# EAGLE design eCog100_ESP8266_Wifi (EAGLE 6.6.0)
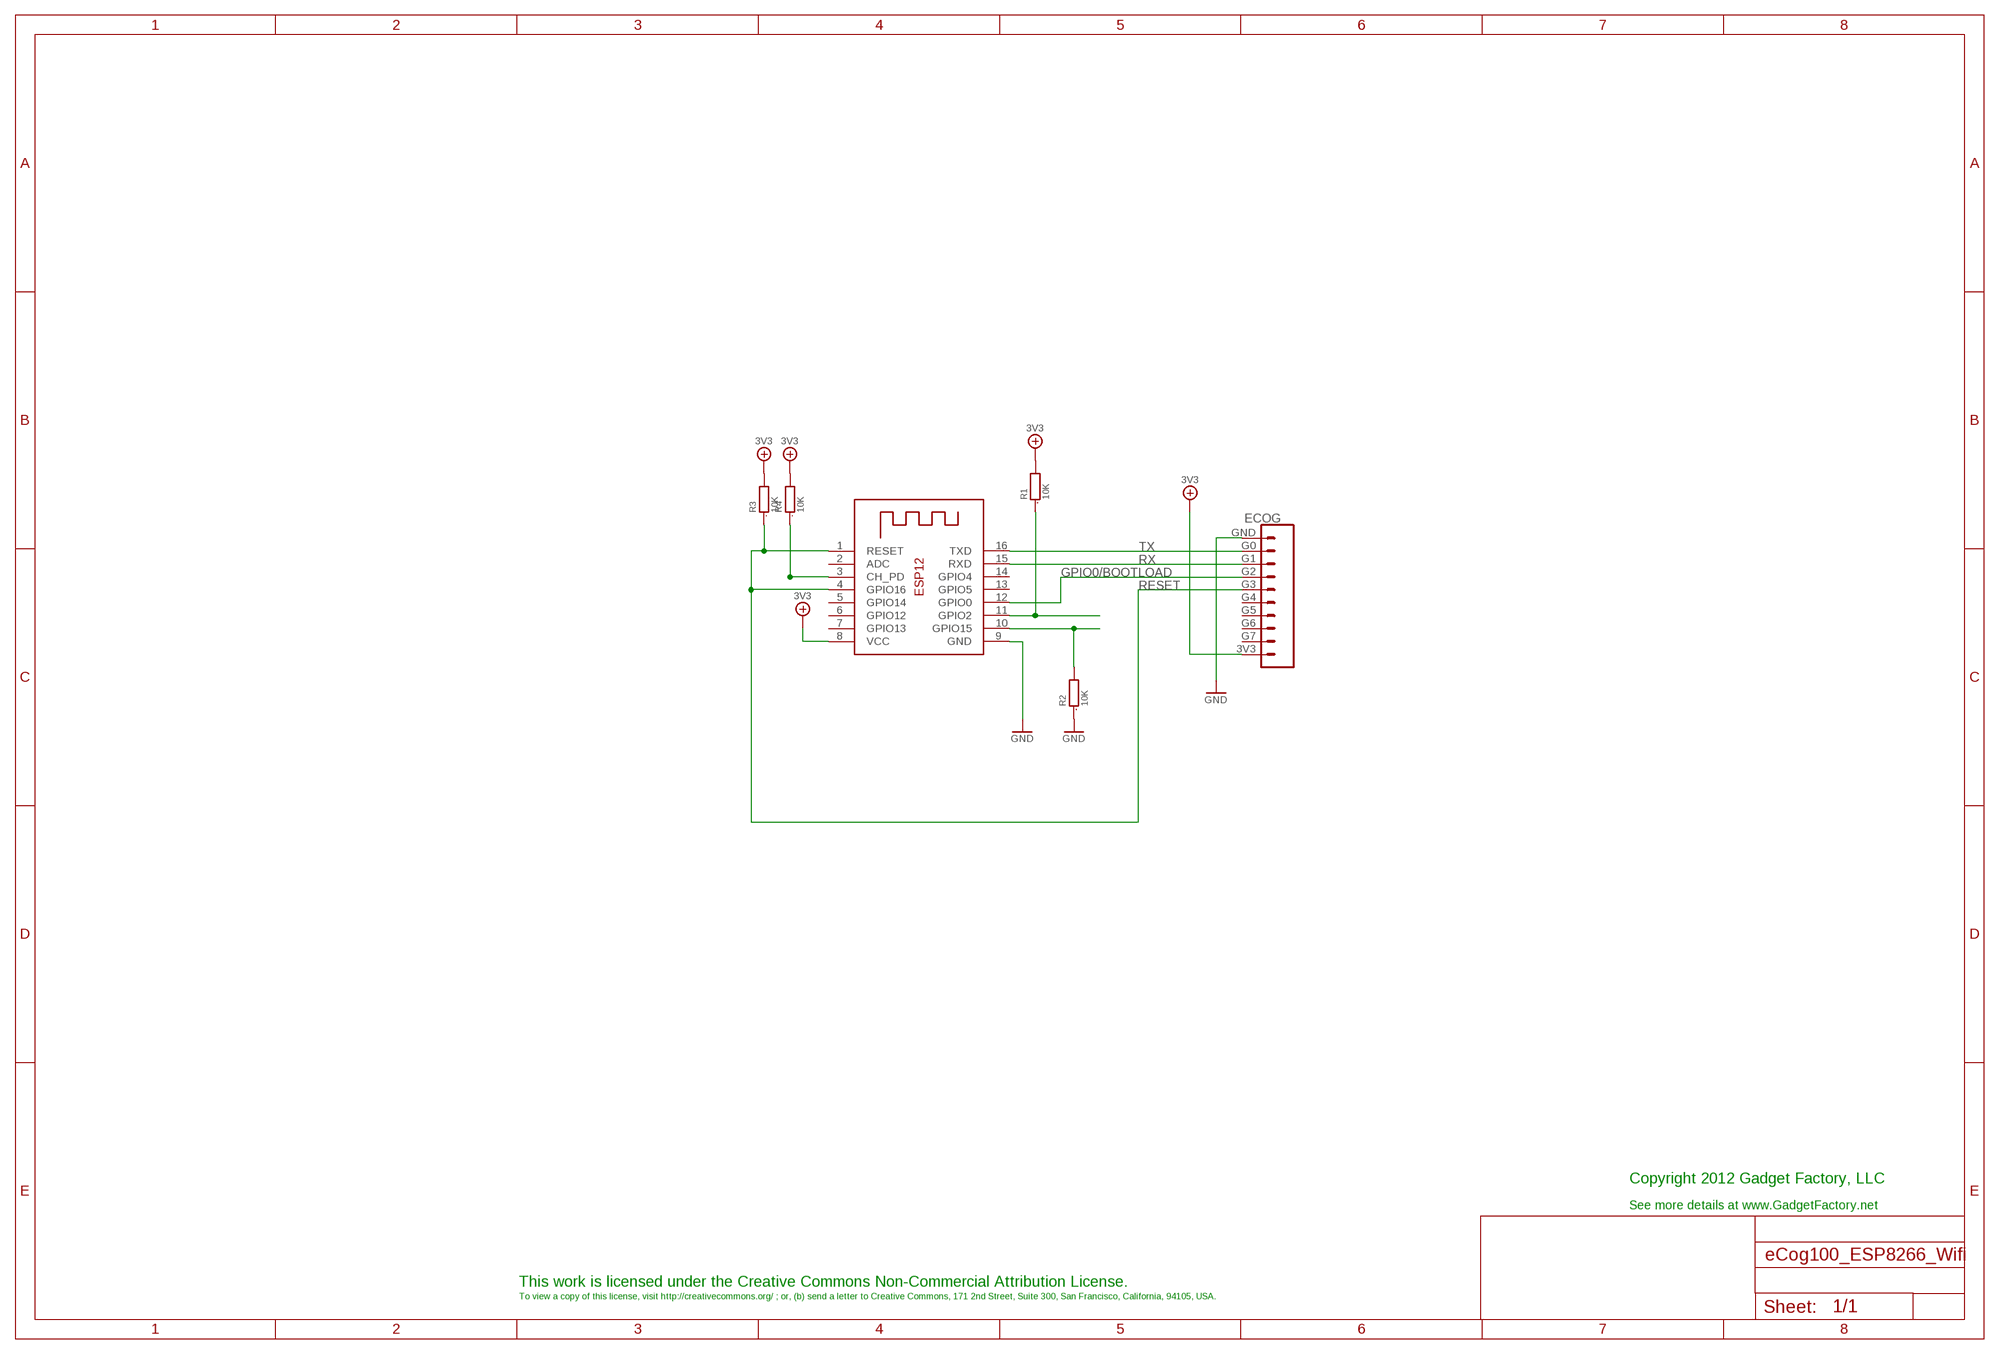
[diagram p0: schematic, sheet 1]

## Parts
ECOG  ECOG_GENERAL_ROWECOG_GENERAL_SMD  [ECOG_GENERAL_SMD]
R1  10K  R0805  [0805]
R2  10K  R0805  [0805]
R3  10K  R0805  [0805]
R4  10K  R0805  [0805]
X1  ESP-12  [ESP-12]

## Nets
3V3: ECOG.3V3 R1.2 R3.2 R4.2 X1.8(VCC)
GND: ECOG.GND R2.1 X1.9(GND)
GPIO0/BOOTLOAD: ECOG.G2 X1.12(GPIO0)
N$3: R1.1 X1.11(GPIO2)
N$4: R2.2 X1.10(GPIO15)
N$5: R4.1 X1.3(CH_PD)
RESET: ECOG.G3 R3.1 X1.1(RESET) X1.4(GPIO16)
RX: ECOG.G1 X1.15(RXD)
TX: ECOG.G0 X1.16(TXD)
Unconnected: ECOG.G4 ECOG.G5 ECOG.G6 ECOG.G7 X1.2(ADC) X1.5(GPIO14) X1.6(GPIO12) X1.7(GPIO13) X1.13(GPIO5) X1.14(GPIO4)

## Notes on the sheet
- Copyright 2012 Gadget Factory, LLC
- See more details at www.GadgetFactory.net
- This work is licensed under the Creative Commons Non-Commercial Attribution License.
- To view a copy of this license, visit http://creativecommons.org/ ; or, (b) send a letter to Creative Commons, 171 2nd Street, Suite 300, San Francisco, California, 94105, USA.

## Library data of the parts
ECOG = eCogs:ECOG_GENERAL_ROW; DIGIKEY: S1013EC-10-ND
R1-R4 = GadgetFactory:R: RESISTOR, European symbol; DIGIKEY: RMCF0805JT10K0CT-ND
X1 = adafruit:ESP-12; ADAFRUIT: 2491

## Board
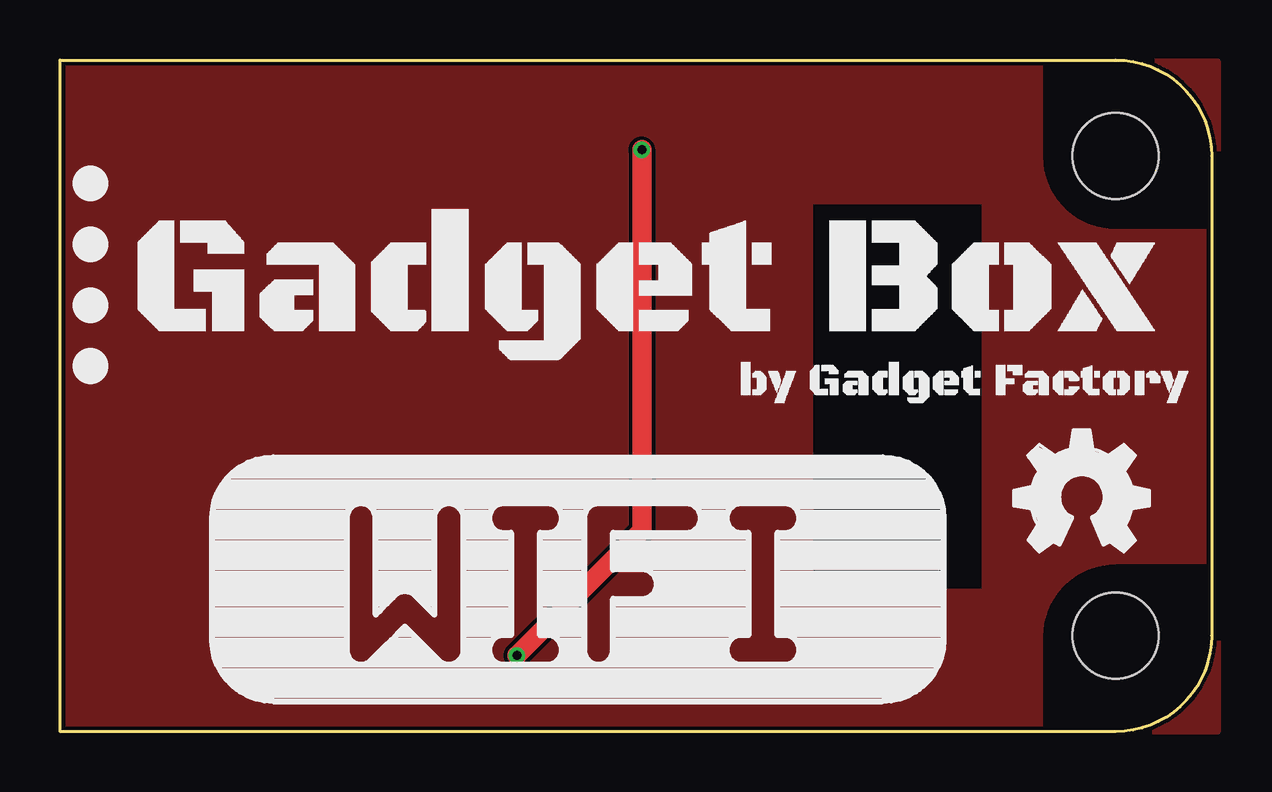
[diagram p1: board, top side]
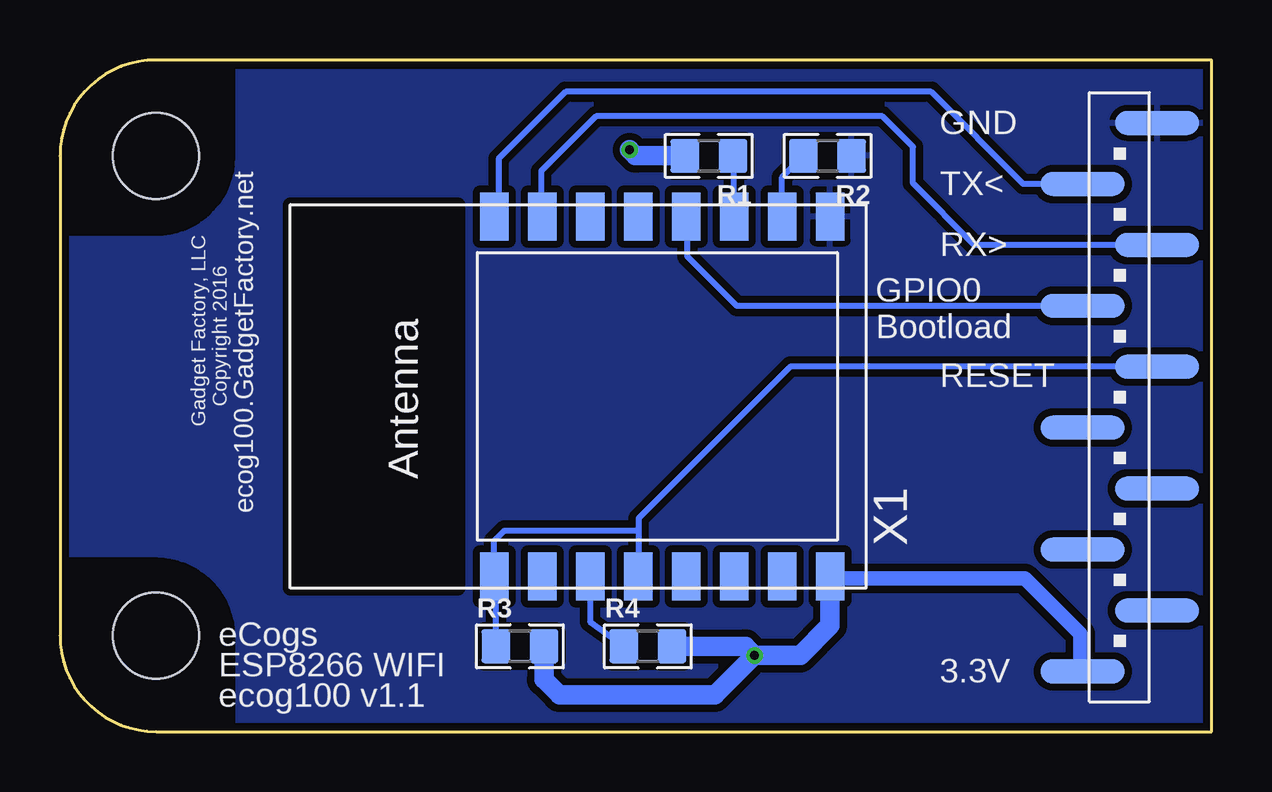
[diagram p2: board, bottom side, seen from below]

Size 48 x 28 mm. Coordinates in mm from the lower left corner, seen from the top.
Copper layers (1*16): Top 0.035mm / dielectric 1.5mm / Bottom 0.035mm
Design rules "hackvana": minimum track width 6mil, minimum drill 0.3mm, track to track 6mil, track to pad 6mil, pad to pad 6mil, via to via 6mil, smd to smd 0mil, copper to edge 6mil, drill to drill 6mil, minimum pad ring 10mil, minimum via ring 6mil, stop-mask expansion 2mil, vias tented up to drill 100mil, thermal gap 10mil

### Footprints (pad centres in the part's own frame; a part is rotated, then mirrored left to right if it is on the bottom)
ECOG_GENERAL_SMD = smd 3.5 x 1 bottom: 3V3 5.369,2.51; G0 5.369,22.83; G1 2.271,20.29; G2 5.369,17.75; G3 2.271,15.21; G4 5.369,12.67; G5 2.271,10.13; G6 5.369,7.59; G7 2.271,5.05; GND 2.271,25.37 | hole 3.6: 44,4; 44,24
0805 = smd 1.2 x 1.4: 1 -1,0; 2 1,0
ESP-12 = smd 2 x 1.2: 1 -7.5,4.5; 2 -7.5,2.5; 3 -7.5,0.5; 4 -7.5,-1.5; 5 -7.5,-3.5; 6 -7.5,-5.5; 7 -7.5,-7.5; 8 -7.5,-9.5; 9 7.5,-9.5; 10 7.5,-7.5; 11 7.5,-5.5; 12 7.5,-3.5; 13 7.5,-1.5; 14 7.5,0.5; 15 7.5,2.5; 16 7.5,4.5

### Placement (x,y rotation side)
ECOG  0,0 0 top
R1  20.95,24 180 bottom
R2  16,24 180 bottom
R3  28.83,3.56 0 bottom
R4  23.5,3.56 0 bottom
U$1  [GADGETBOX_TEXT]  24.51,18.41 0 top
U$2  [LEGEND_DIO]  1.27,22.86 0 top
U$3  [LEGEND_DIO]  1.27,20.32 0 top
U$4  [LEGEND_DIO]  1.27,17.78 0 top
U$5  [LEGEND_DIO]  1.27,15.24 0 top
U$6  [OSHW_FILLX200_NOTEXT]  39.75,7.49 0 top
X1  25.4,13.97 90 bottom

### Tracks (layer width: path | path; a pad name or v marks a point on that pad's centre or on a via)
3V3  (via drill 0.38)
  Top 0.813: v24.26,24.26 24.26,8.38 v19.05,3.17
  Bottom 0.61: 15.81,6.38 7.78,6.38 5.46,4.06 5.46,2.6 ECOG.3V3
  Bottom 0.813: 15.81,6.38 X1.8 15.9,4.42 17.14,3.17 v19.05,3.17 | R4.2 19.43,3.56 v19.05,3.17 | R3.2 27.83,2.17 27.18,1.52 20.7,1.52 v19.05,3.17 | R1.2 24,24 v24.26,24.26
GND
  pour Bottom (isolate 0.305): 0,28 48,28 48,0 0,0
  pour Top: 0,27.94 48.26,27.94 48.26,0 0,0
GPIO0/BOOTLOAD
  Bottom 0.254: ECOG.G2 19.78,17.75 21.84,19.81 21.84,21.41 X1.12
N$3
  Bottom 0.254: X1.11 19.9,23.95 R1.1
N$4
  Bottom 0.254: X1.10 17.9,23.11 R2.2
N$5
  Bottom 0.254: X1.3 25.9,4.58 R4.1
RESET
  Bottom 0.254: ECOG.G3 17.56,15.21 23.88,8.89 23.88,8.38 | 23.88,8.38 23.88,6.49 X1.4 | R3.1 29.83,6.4 X1.1 29.9,7.95 29.46,8.38 23.88,8.38
RX
  Bottom 0.254: ECOG.G1 9.88,20.29 12.45,22.86 12.45,24.38 13.72,25.65 25.65,25.65 27.94,23.37 27.94,21.51 X1.15
TX
  Bottom 0.254: ECOG.G0 7.84,22.83 11.68,26.67 26.92,26.67 29.72,23.88 29.72,21.65 X1.16

### Text on the board
bPlace: GND | ecog100.GadgetFactory.net | TX< | Gadget Factory, LLC | RX> | Copyright 2016 | GPIO0 / Bootload | RESET | eCogs | 3.3V | ESP8266 WIFI | ecog100 v1.1